# Altium schematic sheet gpio_pcal9535a_expander.SchDoc
size A
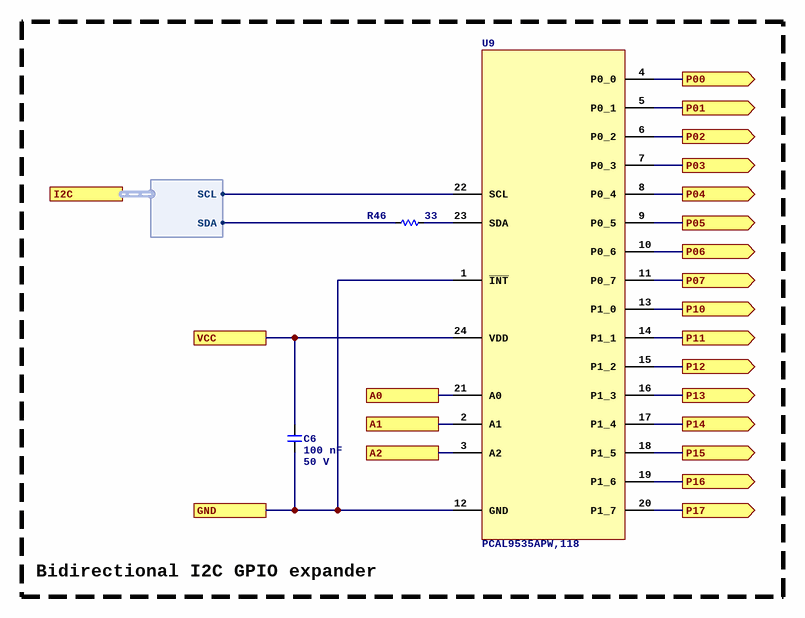
[diagram p0: gpio_pcal9535a_expander.SchDoc]

## Parts
C6  Capacitance: 100 nF  Voltage Rating: 50 V  [C0402]  (hidden comment: CL05B104KB54PNC)
R46  value 33  [R0402]  (hidden comment: CRCW040233R0FKED)
U9  PCAL9535APW,118  [24TSSOP65]

## Blocks framed on the sheet
Bidirectional I2C GPIO expander: C6 R46 U9

## Ports
A0, A1, A2, GND, I2C (harness I2C), P00 (out), P01 (out), P02 (out), P03 (out), P04 (out), P05 (out), P06 (out), P07 (out), P10 (out), P11 (out), P12 (out), P13 (out), P14 (out), P15 (out), P16 (out), P17 (out), VCC

## Harnesses
I2C: SCL, SDA

## Nets
A0: U9.21(A0) ; port A0
A1: U9.2(A1) ; port A1
A2: U9.3(A2) ; port A2
GND: C6.2 U9.1(~{INT}) U9.12(GND) ; port GND
P00: U9.4(P0_0) ; port P00
P01: U9.5(P0_1) ; port P01
P02: U9.6(P0_2) ; port P02
P03: U9.7(P0_3) ; port P03
P04: U9.8(P0_4) ; port P04
P05: U9.9(P0_5) ; port P05
P06: U9.10(P0_6) ; port P06
P07: U9.11(P0_7) ; port P07
P10: U9.13(P1_0) ; port P10
P11: U9.14(P1_1) ; port P11
P12: U9.15(P1_2) ; port P12
P13: U9.16(P1_3) ; port P13
P14: U9.17(P1_4) ; port P14
P15: U9.18(P1_5) ; port P15
P16: U9.19(P1_6) ; port P16
P17: U9.20(P1_7) ; port P17
VCC: C6.1 U9.24(VDD) ; port VCC
NetR46_1: R46.1 U9.23(SDA)
NetR46_2: R46.2 ; port I2C.SDA
NetU9_22: U9.22(SCL) ; port I2C.SCL

## Library data of the parts
C6 = CL05B104KB54PNC: Manufacturer: Samsung Electro-Mechanics; Dielectric: X7R; ComponentLink1URL: https://wmsc.lcsc.com/wmsc/upload/file/pdf/v2/lcsc/2304140030_Samsung-Electro-Mechanics-CL05B104KB54PNC_C307331.pdf; ComponentLink1Description: Datasheet; Manufacturer Part Number: CL05B104KB54PNC; Package: 0402; Supplier 2: LCSC; Supplier Part Number 2: C307331
R46 = CRCW040233R0FKED: Manufacturer: Vishay Intertech; Tolerance: 1%; Temperature Coefficient: ±100ppm/?; Power Rating (mW): 63; ComponentLink1Description: Datasheet; ComponentLink1URL: https://wmsc.lcsc.com/wmsc/upload/file/pdf/v2/lcsc/2304140030_Vishay-Intertech-CRCW040233R0FKED_C242490.pdf; Manufacturer Part Number: CRCW040233R0FKED; Package: 0402; Supplier 2: LCSC; Supplier Part Number 2: C242490
U9 = PCAL9535APW,118: 16-bit I2C/SMBus I/O expander, 400 kHz, with interrupt and Agile I/O, TSSOP-24; Manufacturer: NXP Semiconductors; Manufacturer Part Number: PCAL9535APW,118; Supplier 1: DigiKey; Supplier 2: LCSC; Supplier Part Number 1: 568-9923-1-ND; Supplier Part Number 2: C2669683; Supplier 3: Mouser; Supplier Part Number 3: 771-PCAL9535APW,118; ComponentLink1Description: Datasheet; ComponentLink1URL: https://www.nxp.com/docs/en/data-sheet/PCAL9535A.pdf